# Altium schematic sheet 03-CTRL1-ps2-blueretro.SchDoc
size A; SheetNumber: 4; SheetTotal: 6
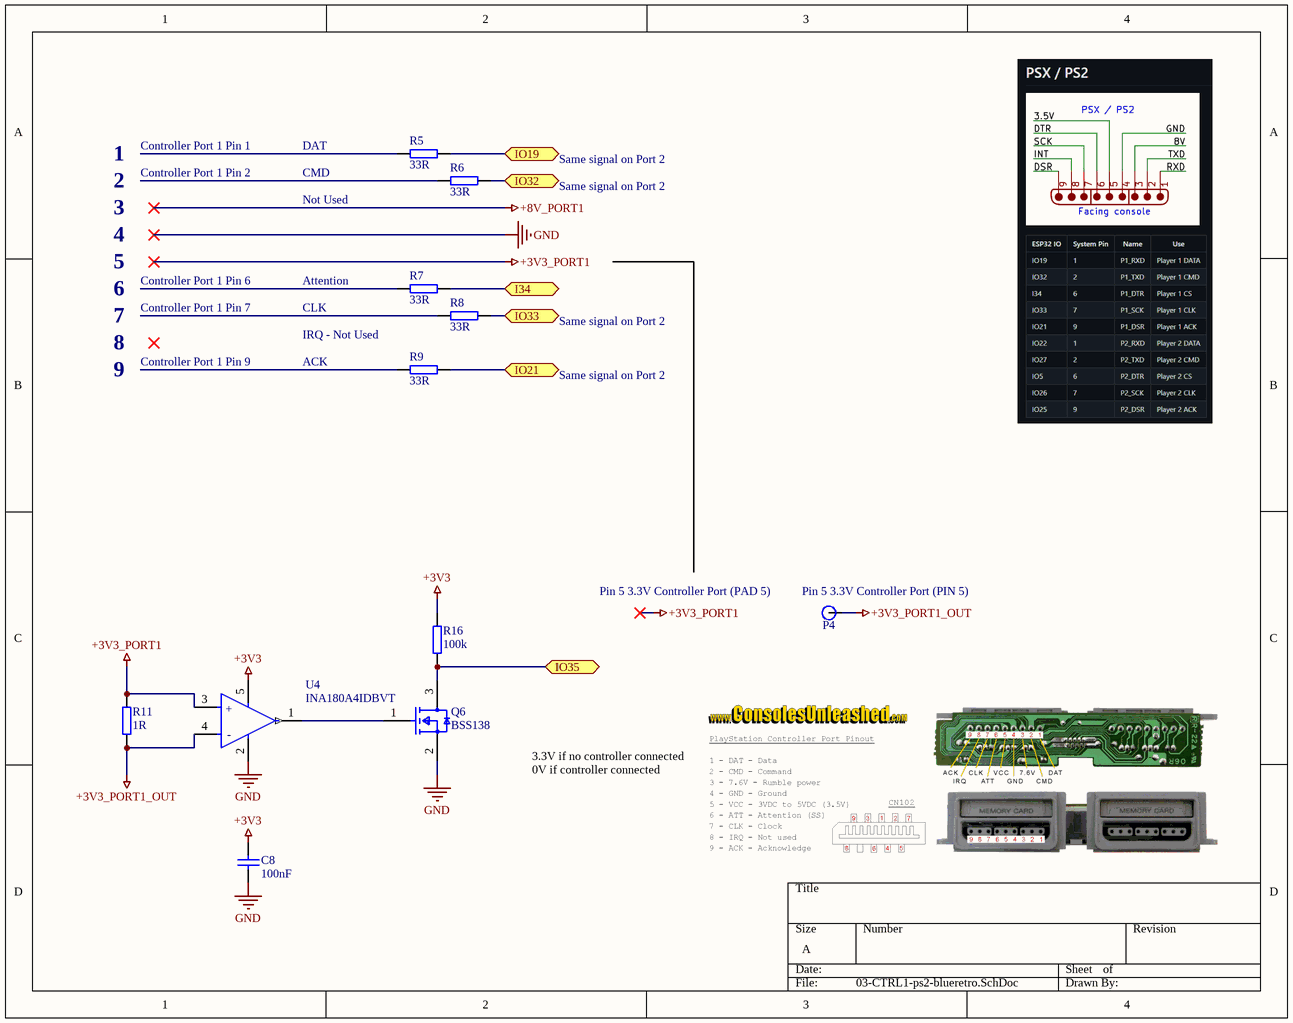
[diagram p0: 03-CTRL1-ps2-blueretro.SchDoc]

## Parts
C8  value 100nF  [res_0402]  (hidden comment: cap_0402)
P4  Solder_Contact_2mm  [SINGLE_SOLDER_CON]  (value not drawn)
Q6  BSS138  [FP-318-08-IPC_B]
R5  value 33R  [res_0402]  (hidden comment: res_0402)
R6  value 33R  [res_0402]  (hidden comment: res_0402)
R7  value 33R  [res_0402]  (hidden comment: res_0402)
R8  value 33R  [res_0402]  (hidden comment: res_0402)
R9  value 33R  [res_0402]  (hidden comment: res_0402)
R11  value 1R  [res_0402]  (hidden comment: res_0402)
R16  value 100k  [res_0603]  (hidden comment: res_0603)
U4  INA180A4IDBVT  [FP-DBV0005A-MFG]

## Ports
I34 (bidir, see 00-ps2-blueretro[3B], 01-ESP32-ps2-blueretro[2C]), IO19 (bidir, see 00-ps2-blueretro[3B], 01-ESP32-ps2-blueretro[2B]), IO21 (bidir, see 00-ps2-blueretro[3B], 01-ESP32-ps2-blueretro[2B]), IO32 (bidir, see 00-ps2-blueretro[3B], 01-ESP32-ps2-blueretro[2B]), IO33 (bidir, see 00-ps2-blueretro[3B], 01-ESP32-ps2-blueretro[2C]), IO35 (bidir, see 00-ps2-blueretro[3B], 01-ESP32-ps2-blueretro[2C])

## Nets
+3V3: C8.1 R16.2 U4.5(VS)
+3V3_PORT1: R11.1 U4.3(IN+)
+3V3_PORT1_OUT: P4.1 R11.2 U4.4(IN-)
GND: C8.2 Q6.2(S) U4.2(GND)
I34: R7.1 ; port I34
IO19: R5.1 ; port IO19
IO21: R9.1 ; port IO21
IO32: R6.1 ; port IO32
IO33: R8.1 ; port IO33
IO35: Q6.3(D) R16.1 ; port IO35
NetQ6_1: Q6.1(G) U4.1(OUT)

Not connected (* = marked no-connect by the designer): R5 2; R6 2; R7 2; R8 2; R9 2

## Notes on the sheet
- 1
- Controller Port 1 Pin 1
- DAT
- Same signal on Port 2
- 2
- 3
- Controller Port 1 Pin 2
- CMD
- Not Used
- 4
- 5
- 6
- Controller Port 1 Pin 6
- (near R7) Attention
- 7
- 8
- Controller Port 1 Pin 7
- Controller Port 1 Pin 9
- CLK
- ACK
- IRQ - Not Used
- 9
- (near P4) Pin 5 3.3V Controller Port (PAD 5)
- (near P4) Pin 5 3.3V Controller Port (PIN 5)
- 3.3V if no controller connected
  0V if controller connected
- (in symbol CMP-04895-000007-1) +; -

## Library data of the parts
Q6 = CMP-07173-000101-1: MOSFET N-CH 50V 220MA SOT-23; Turn-Off Delay Time: 20ns; Element Configuration: Single; Rds On Max: 3.5R; Gate to Source Voltage (Vgs): 20V; Threshold Voltage: 1.3V; Number of Elements: 1; Power Dissipation: 360mW; Rise Time: 9ns; Turn-On Delay Time: 2.5ns; Input Capacitance: 27pF; On-State Resistance: 6R; Lead Free: Lead Free; Length: 2.92mm; Width: 1.3mm; Drain to Source Breakdown Voltage: 50V; Min Operating Temperature: -55°C; REACH SVHC: No SVHC; Packaging: Tape and Reel; Radiation Hardening: No; Height: 0.93mm; Drain to Source Voltage (Vdss): 50V; Current Rating: 220mA; Voltage Rating (DC): 50V; Weight: 0.03g; Continuous Drain Current (ID): 220mA; Number of Pins: 3; Nominal Vgs: 1.3V; Max Power Dissipation: 360mW; Fall Time: 9ns; Drain to Source Resistance: 3.5R; Contact Plating: Tin; Case/Package: SOT-23; Package Quantity: 1; Dual Supply Voltage: 50V; Mount: Surface Mount; Termination: SMD/SMT; Max Operating Temperature: 150°C
U4 = CMP-04895-000007-1: IC CURR SENSE 1 CIRCUIT SOT23-5; Manufacturer: Texas Instruments; Output Current Per Channel: 8mA; Max Supply Voltage: 5.5V; Input Bias Current: 80uA; Bandwidth: 105kHz; Min Supply Voltage: 2.7V; Input Offset Voltage: 0.1mV; Number Of Channels: 1; Max Junction Temp: +150°C; Standoff Height: 0mm; Nominal Supply Current: 197uA; Voltage Gain: 0.2V/mV; Temperature: -40°C to +125°C; RoHS: TRUE; Ambient Temperature Range High: +125°C; Device Class L3: Instrumentation; Temperature Range High: +125°C; Height: 1.45mm; Octopart: https://octopart.com/ina180a4idbvt-texas+instruments-81856280; ComponentLink2Description: Datasheet; Digikey Description: IC CURR SENSE 1 CIRCUIT SOT23-5; Category: IC; ComponentLink2URL: http://www.ti.com/lit/ds/symlink/ina180.pdf; Ambient Temperature Range Low: -40°C; Temperature Range Low: -40°C; Automotive: No; Package: DBV0005A; Device Class L1: Integrated Circuits (ICs); Ipc Land Pattern Name: SOT95P280X145-5; Manufacturer Part Number: INA180A4IDBVT; Device Class L2: Linear ICs; Lead Free: Yes